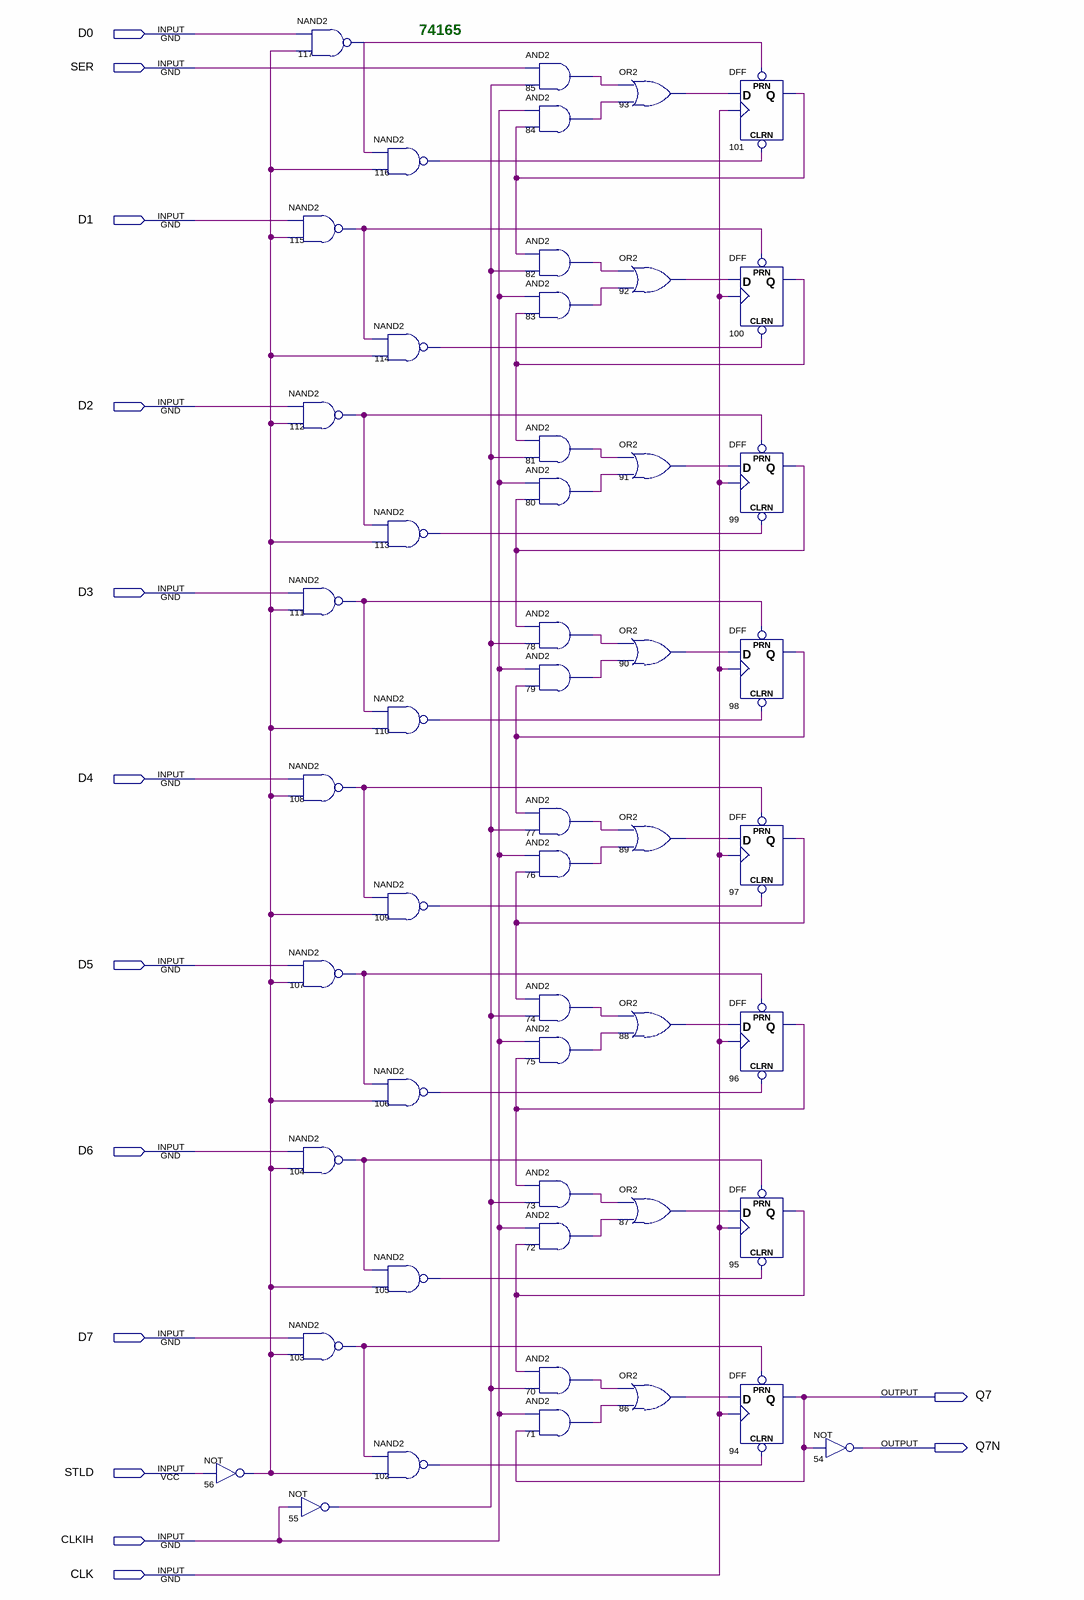
[diagram p0: schematic sheet]
// Quartus schematic 74165b.bdf as structural Verilog: 51 symbols, 14 pins
module \74165b  (
  input  D0,
  input  SER,
  input  D1,
  input  D2,
  input  D3,
  input  D4,
  input  D5,
  input  D6,
  input  D7,
  input  STLD,
  input  CLKIH,
  input  CLK,
  output Q7,
  output Q7N
);

  wire n55_out, n56_out, n70_out, n71_out, n72_out, n73_out, n74_out, n75_out, n76_out, n77_out, n78_out,
       n79_out, n80_out, n81_out, n82_out, n83_out, n84_out, n85_out, n86_out, n87_out, n88_out, n89_out,
       n90_out, n91_out, n92_out, n93_out, n95_q, n96_q, n97_q, n98_q, n99_q, n100_q, n101_q, n102_out,
       n103_out, n104_out, n105_out, n106_out, n107_out, n108_out, n109_out, n110_out, n111_out, n112_out,
       n113_out, n114_out, n115_out, n116_out, n117_out;

  not u_56 (n56_out, STLD);
  nand u_117 (n117_out, D0, n56_out);
  nand u_115 (n115_out, D1, n56_out);
  nand u_112 (n112_out, D2, n56_out);
  nand u_111 (n111_out, D3, n56_out);
  nand u_108 (n108_out, D4, n56_out);
  nand u_107 (n107_out, D5, n56_out);
  nand u_104 (n104_out, D6, n56_out);
  nand u_103 (n103_out, D7, n56_out);
  not u_55 (n55_out, CLKIH);
  nand u_116 (n116_out, n117_out, n56_out);
  nand u_114 (n114_out, n115_out, n56_out);
  nand u_113 (n113_out, n112_out, n56_out);
  nand u_110 (n110_out, n111_out, n56_out);
  nand u_109 (n109_out, n108_out, n56_out);
  nand u_106 (n106_out, n107_out, n56_out);
  nand u_105 (n105_out, n104_out, n56_out);
  nand u_102 (n102_out, n103_out, n56_out);
  and u_85 (n85_out, SER, n55_out);
  and u_84 (n84_out, CLKIH, n101_q);
  and u_82 (n82_out, n101_q, n55_out);
  and u_83 (n83_out, CLKIH, n100_q);
  and u_81 (n81_out, n100_q, n55_out);
  and u_80 (n80_out, CLKIH, n99_q);
  and u_78 (n78_out, n99_q, n55_out);
  and u_79 (n79_out, CLKIH, n98_q);
  and u_77 (n77_out, n98_q, n55_out);
  and u_76 (n76_out, CLKIH, n97_q);
  and u_74 (n74_out, n97_q, n55_out);
  and u_75 (n75_out, CLKIH, n96_q);
  and u_73 (n73_out, n96_q, n55_out);
  and u_72 (n72_out, CLKIH, n95_q);
  and u_70 (n70_out, n95_q, n55_out);
  and u_71 (n71_out, CLKIH, Q7);
  or u_93 (n93_out, n85_out, n84_out);
  or u_92 (n92_out, n82_out, n83_out);
  or u_91 (n91_out, n81_out, n80_out);
  or u_90 (n90_out, n78_out, n79_out);
  or u_89 (n89_out, n77_out, n76_out);
  or u_88 (n88_out, n74_out, n75_out);
  or u_87 (n87_out, n73_out, n72_out);
  or u_86 (n86_out, n70_out, n71_out);
  DFF u_101 (.CLRN(n116_out), .CLK(CLK), .D(n93_out), .PRN(n117_out), .Q(n101_q));
  DFF u_100 (.CLRN(n114_out), .CLK(CLK), .D(n92_out), .PRN(n115_out), .Q(n100_q));
  DFF u_99 (.CLRN(n113_out), .CLK(CLK), .D(n91_out), .PRN(n112_out), .Q(n99_q));
  DFF u_98 (.CLRN(n110_out), .CLK(CLK), .D(n90_out), .PRN(n111_out), .Q(n98_q));
  DFF u_97 (.CLRN(n109_out), .CLK(CLK), .D(n89_out), .PRN(n108_out), .Q(n97_q));
  DFF u_96 (.CLRN(n106_out), .CLK(CLK), .D(n88_out), .PRN(n107_out), .Q(n96_q));
  DFF u_95 (.CLRN(n105_out), .CLK(CLK), .D(n87_out), .PRN(n104_out), .Q(n95_q));
  DFF u_94 (.CLRN(n102_out), .CLK(CLK), .D(n86_out), .PRN(n103_out), .Q(Q7));
  not u_54 (Q7N, Q7);

  // Notes on the sheet:
  //   74165
endmodule
